# Altium project SensorStick - RX.PrjPcb
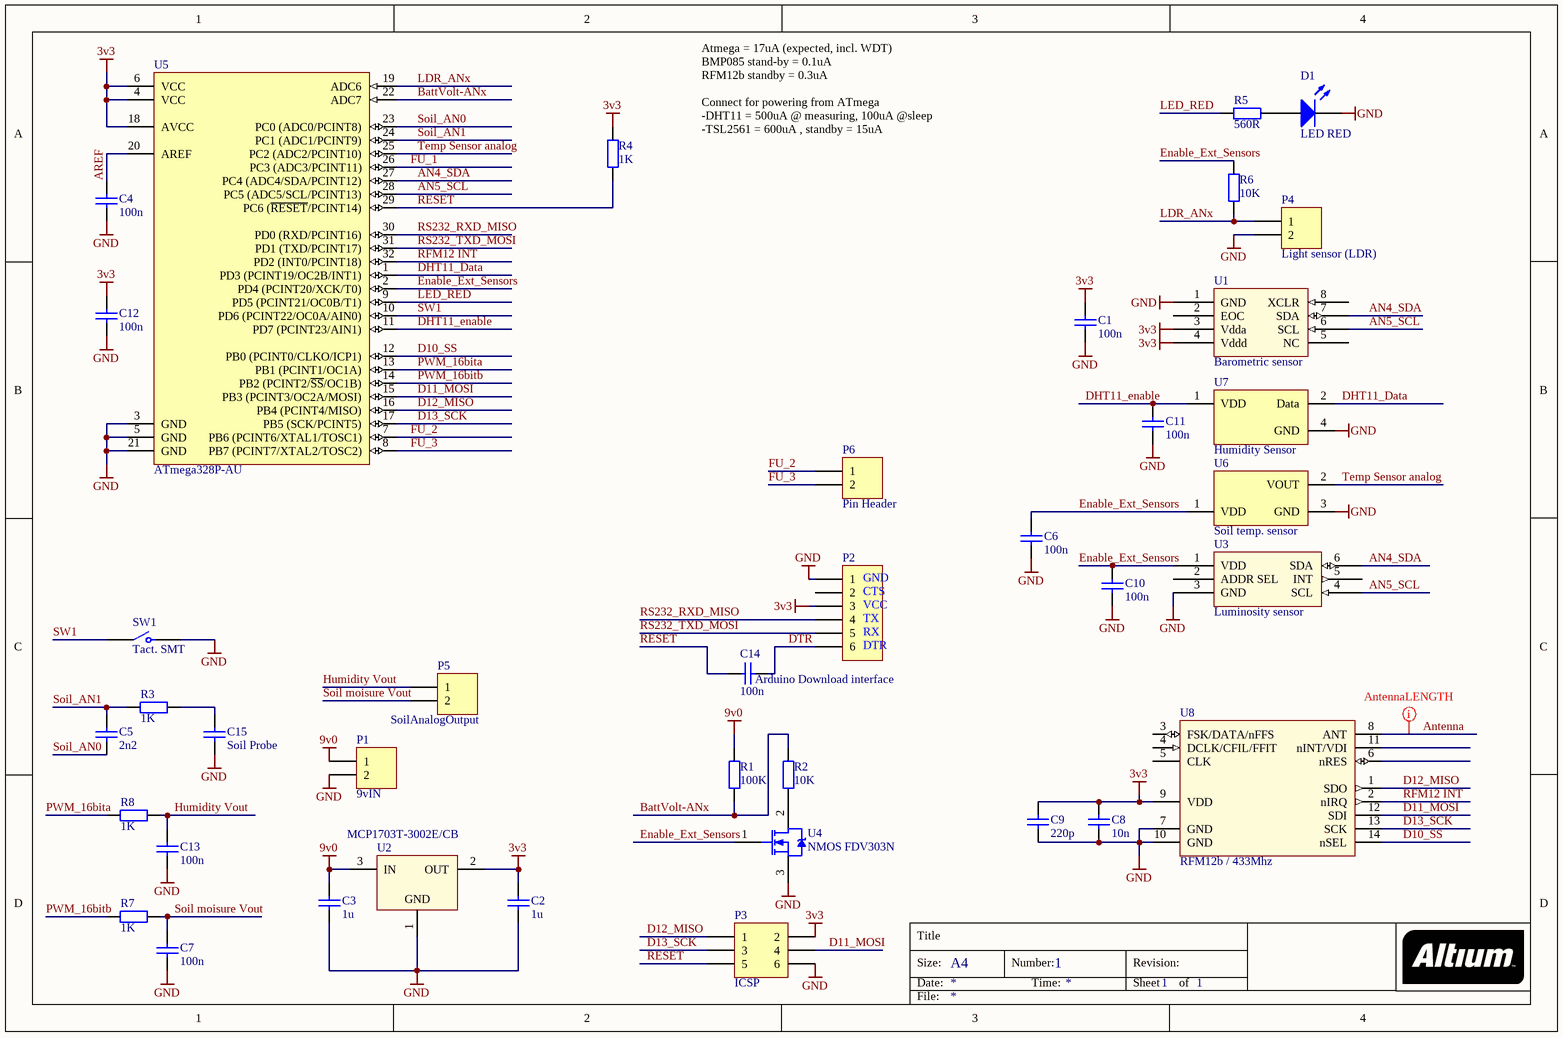
[diagram p0: main.SchDoc]
1 sheet, 39 parts. Net scope: hierarchical (ports join the sheet entries above them; power ports are global).
Board file: pcb.PcbDoc

## Sheet main.SchDoc
size A4; DocumentNumber: 1; SheetNumber: 1; SheetTotal: 1; PageSetup: Record=PageOptions|CenterHorizontal=True|CenterVertical=True|PrintScale=0.98|XCorrection=1.00|YCorrection=1.00|PrintKind=0|BorderSize=5000000|LeftOffset=0|BottomOffset=0|Orientation=2|PaperLength=1000|PaperWidth=1000|Scale=100|PaperSource=7|PrintQuality=-4|MediaType=1|DitherType=10|PaperKind=A4|PrintScaleMode=1

### Parts
C1  100n  [C0805]
C2  1u  [C0805]
C3  1u  [C0805]
C4  100n  [C0805]
C5  2n2  [C0805]
C6  100n  [C0805]
C7  100n  [C0805]
C8  10n  [C0805]
C9  220p  [C0805]
C10  100n  [C0805]
C11  100n  [C0805]
C12  100n  [C0805]
C13  100n  [C0805]
C14  100n  [C0805]
C15  Soil Probe  [C0805]
D1  LED RED  [LED-3mm]
P1  9vIN  [PH1x2_2.54]
P2  Arduino Download interface  [PH1x6_2.54]
P3  ICSP  [PH2x3_2.54]
P4  Light sensor (LDR)  [PH1x2_2.54]
P5  SoilAnalogOutput  [PH1x2_2.54]
P6  Pin Header  [PH1x2_2.54]
R1  Part Number: 100K  [R0805]  (hidden comment: RESISTOR)
R2  Part Number: 10K  [R0805]  (hidden comment: RESISTOR)
R3  Part Number: 1K  [R0805]  (hidden comment: RESISTOR)
R4  Part Number: 1K  [R0805]  (hidden comment: RESISTOR)
R5  Part Number: 560R  [R0805]  (hidden comment: RESISTOR)
R6  Part Number: 10K  [R0805]  (hidden comment: RESISTOR)
R7  Part Number: 1K  [R0805]  (hidden comment: RESISTOR)
R8  Part Number: 1K  [R0805]  (hidden comment: RESISTOR)
SW1  Tact. SMT  [Switch TACT 3.5*6]
U1  Barometric sensor  [BMP085]
U2  Part Number: MCP1703T-3002E/CB  [SOT23]  (hidden comment: MCP1703T)
U3  Luminosity sensor  [TSL2561]
U4  NMOS FDV303N  [SOT-23-FET]
U5  ATmega328P-AU  [atmel_32A_N]
U6  Soil temp. sensor  [SOT-23-TT3_M]
U7  Humidity Sensor  [DHTXX]
U8  RFM12b / 433Mhz  [RFM12_dev]

### Nets
3v3: C1.2 C2.2 C8.2 C9.2 C12.2 P2.3 P3.2 R4.1 U1.3(Vdda) U1.4(Vddd) U2.2(OUT) U5.4(VCC) U5.6(VCC) U5.18(AVCC) U8.9(VDD)
9v0: C3.2 P1.1 R1.1 U2.3(IN)
GND: C1.1 C2.1 C3.1 C4.1 C6.1 C7.1 C8.1 C9.1 C10.1 C11.1 C12.1 C13.1 C15.1 D1.2(K) P1.2 P2.1 P3.6 P4.2 SW1.2 U1.1(GND) U2.1(GND) U3.3(GND) U4.3(S) U5.3(GND) U5.5(GND) U5.21(GND) U6.3(GND) U7.4(GND) U8.7(GND) U8.10(GND)
AN4_SDA: U1.7(SDA) U3.6(SDA) U5.27(PC4_(ADC4/SDA/PCINT12))
AN5_SCL: U1.6(SCL) U3.4(SCL) U5.28(PC5_(ADC5/SCL/PCINT13))
Antenna: U8.8(ANT)
AREF: C4.2 U5.20(AREF)
BattVolt-ANx: R1.2 R2.2 U5.22(ADC7)
D10_SS: U5.12(PB0_(PCINT0/CLKO/ICP1)) U8.14(nSEL)
D11_MOSI: P3.4 U5.15(PB3_(PCINT3/OC2A/MOSI)) U8.12(SDI)
D12_MISO: P3.1 U5.16(PB4_(PCINT4/MISO)) U8.1(SDO)
D13_SCK: P3.3 U5.17(PB5_(SCK/PCINT5)) U8.13(SCK)
DHT11_Data: U5.1(PD3_(PCINT19/OC2B/INT1)) U7.2(Data)
DHT11_enable: C11.2 U5.11(PD7_(PCINT23/AIN1)) U7.1(VDD)
DTR: C14.2 P2.6
Enable_Ext_Sensors: C6.2 C10.2 R6.1 U3.1(VDD) U4.1(G) U5.2(PD4_(PCINT20/XCK/T0)) U6.1(VDD)
FU_1: U5.26(PC3_(ADC3/PCINT11))
FU_2: P6.1 U5.7(PB6_(PCINT6/XTAL1/TOSC1))
FU_3: P6.2 U5.8(PB7_(PCINT7/XTAL2/TOSC2))
Humidity Vout: C13.2 P5.1 R8.1
LDR_ANx: P4.1 R6.2 U5.19(ADC6)
LED_RED: R5.1 U5.9(PD5_(PCINT21/OC0B/T1))
PWM_16bita: R8.2 U5.13(PB1_(PCINT1/OC1A))
PWM_16bitb: R7.2 U5.14(PB2_(PCINT2/~{SS}/OC1B))
RESET: C14.1 P3.5 R4.2 U5.29(PC6_(~{RESET}/PCINT14))
RFM12 INT: U5.32(PD2_(INT0/PCINT18)) U8.2(nIRQ)
RS232_RXD_MISO: P2.4 U5.30(PD0_(RXD/PCINT16))
RS232_TXD_MOSI: P2.5 U5.31(PD1_(TXD/PCINT17))
Soil moisure Vout: C7.2 P5.2 R7.1
Soil_AN0: C5.1 U5.23(PC0_(ADC0/PCINT8))
Soil_AN1: C5.2 R3.2 U5.24(PC1_(ADC1/PCINT9))
SW1: SW1.1 U5.10(PD6_(PCINT22/OC0A/AIN0))
Temp Sensor analog: U5.25(PC2_(ADC2/PCINT10)) U6.2(VOUT)
NetC15_2: C15.2 R3.1
NetD1_1: D1.1(A) R5.2
NetR2_1: R2.1 U4.2(D)

Not connected (* = marked no-connect by the designer): P2 2; U1 2(EOC) 5(NC) 8(XCLR); U3 2(ADDR_SEL) 5(INT); U8 3(FSK/DATA/nFFS) 4(DCLK/CFIL/FFIT) 5(CLK) 6(nRES) 11(nINT/VDI)

### Layout directives
rule Length Constraint [Min Length = 164.7mm    Max Length = 164.71mm]: Antenna

### Notes on the sheet
- Atmega = 17uA (expected, incl. WDT)
  BMP085 stand-by = 0.1uA
  RFM12b standby = 0.3uA
  Connect for powering from ATmega
  -DHT11 = 500uA @ measuring, 100uA @sleep
  -TSL2561 = 600uA , standby = 15uA
- Maybe need to add SMD resistor between data and 3v3
- (near P2) GND
- (near P2) CTS
- (near P2) VCC
- (near P2) TX
- (near P2) RX
- (near P2) DTR
- Title
- Size:
- Date:
- A4
- Number:
- Time:
- Revision:
- Sheet
- of
- File:

### Library data of the parts
C15 = 18p: Part Number: 18p; ClassName: SoilProbe
D1 = Red-3mm: LED, Surface Mount LED Indicator; Part Number: Red-3mm
P1 P4 P5 = PH1x2: Con1x2; Part Number: PH1x2
  P4: ClassName: SensorLDR
  P5: ClassName: SensorOutput
P2 = PH1x6: Con1x6; Part Number: PH1x6; ClassName: ArduinoDownload
P3 = PH2x3: Header, 3-Pin, Dual row; Part Number: PH2x3
P6 = PH1x2: Con1x2; Part Number: PH1x2; Pitch: 2.54; LatestRevision Note: Initial Release; Type: Pin Header; Number Of Pins: 2; Component Type: Standard; LatestRevision Date: 23/11/2010; Author: Willy Pietersz; Supplier 1: Farnell
R1 = 100K: Published: 8-Jun-2000; LatestRevisionDate: 17-Jul-2002; LatestRevisionNote: Re-released for DXP Platform.; PackageReference: AXIAL-0.4; Publisher: Altium Limited; ClassName: SensVoltageBatt
R2 R6 = 10K: Published: 8-Jun-2000; LatestRevisionDate: 17-Jul-2002; LatestRevisionNote: Re-released for DXP Platform.; PackageReference: AXIAL-0.4; Publisher: Altium Limited
  R2: ClassName: SensVoltageBatt
  R6: ClassName: SensorLDR
R3 R4 R7 R8 = 1K: Published: 8-Jun-2000; LatestRevisionDate: 17-Jul-2002; LatestRevisionNote: Re-released for DXP Platform.; PackageReference: AXIAL-0.4; Publisher: Altium Limited
  R3: ClassName: SoilProbe
  R7 R8: ClassName: SensorOutput
R5 = 560R: Published: 8-Jun-2000; LatestRevisionDate: 17-Jul-2002; LatestRevisionNote: Re-released for DXP Platform.; PackageReference: AXIAL-0.4; Publisher: Altium Limited
SW1 = Pushbutton TACT mini 3.5x6: Switch; Current: 0.1; Voltage: 42; LatestRevision Note: Initial Release; Part Number: Pushbutton TACT mini 3.5x6; Component Type: Switch; LatestRevision Date: 4/10/2010; Author: Willem Pietersz; Supplier 1: Farnell; Supplier Part Number 1: 9471898; Supplier 2: Digi-Key; Supplier Part Number 2: 679-2307-1-ND; Number Of Pins: 4
U1 = BMP085: Sensor, Barometric; Part Number: BMP085
U2 = MCP1703T-3002E/CB: Regulator, 5v; ClassName: Regulator3v3
U3 = TSL2561: Sensor, Illumination; Part Number: TSL2561
U4 = IRLML0100TRPBF: Transistor; Part Number: FDV303N; ClassName: SensVoltageBatt
U5 = ATmega328P-AU: 8-bit AVR Microcontroller, 32KB Flash, 1KB EEPROM, 2KB SRAM, 32-pin TQFP, Industrial Grade (-40°C to 85°C); Published: 1-Apr-2010; DatasheetVersion: revA, Jan-2010; PackageVersion: revB, Oct-2001; PackageReference: 32A; Publisher: Altium Limited; PackageDescription: 32-Lead, 7x7x1.0 mm Body, 0.8mm Lead Pitch, Thin Profile Plastic Quad Flat Package (TQFP); Supplier 1: Digi-Key; Supplier Part Number 1: ATMEGA328P-AU-ND; Supplier 2: Farnell; Supplier Part Number 2: 1715486; Supplier 3: Mouser; Supplier Part Number 3: 556-ATMEGA328P-AU; Code_JEDEC: MS-026-ABA; ComponentLink1Description: Manufacturer Link; ComponentLink1URL: http://www.atmel.com/products/avr/default.asp?; ComponentLink2Description: ATmega48A/48PA/88A/88PA/168A/168PA/328/328P Datasheet; ComponentLink2URL: http://www.atmel.com/dyn/resources/prod_documents/8271.pdf; ComponentLink3Description: ATmega48A/48PA/88A/88PA/168A/168PA/328/328P Summary; ComponentLink3URL: http://www.atmel.com/dyn/resources/prod_documents/8271S.pdf; ComponentLink4Description: Atmel.com Home; ComponentLink4URL: http://www.atmel.com
U6 = MCP9700AT-E/TT: Low-Power Linear Active Thermistor IC, 3-Pin SOT-23, Extended Temperature, Tape and Reel; DatasheetVersion: revE, Apr-2009; PackageVersion: revBB, Aug-2009; PackageReference: SOT-23-TT3; PackageDescription: 3-Lead Plastic Small Outline Transistor (TT) [SOT-23]; Code_IPC: SOT23-3; ComponentLink1Description: Manufacturer URL; ComponentLink1URL: http://www.microchip.com/; ComponentLink2Description: Datasheet; ComponentLink2URL: http://ww1.microchip.com/downloads/en/DeviceDoc/21942e.pdf; ComponentLink3Description: Package Specification; ComponentLink3URL: http://www.microchip.com/stellent/groups/techpub_sg/documents/packagingspec/en012702.pdf; Part Number: MCP9700AT-E/TT
U7 = DHT11: Humidity / Temp Sensor; Part Number: DHT11
U8 = RFM12b: Wireless, Transceiver; RoHS: Y; Part Number: RFM12b; ClassName: RFM12B
C1 C4 C6 C7 C10-C14 = 100n: Part Number: 100n
  C7 C13: ClassName: SensorOutput
  C14: ClassName: ArduinoDownload
C2 C3 = 1u: Part Number: 1u; ClassName: Regulator3v3
C5 = 2n2: Part Number: 2n2; ClassName: SoilProbe
C8 = 10n: Part Number: 10n; ClassName: RFM12B
C9 = 220p: Part Number: 220p; ClassName: RFM12B